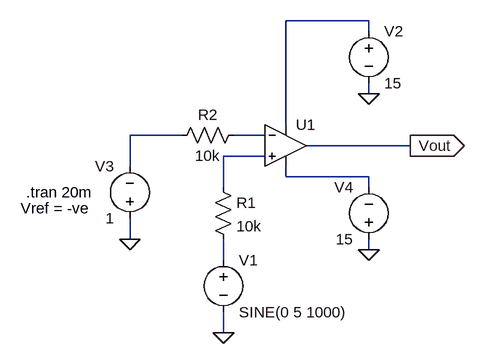
[diagram p0: schematic comparator_negref.asc]
comparator_negref.asc, the LTspice schematic file:
Version 4
SHEET 1 880 680
WIRE 400 -16 272 -16
WIRE 400 0 400 -16
WIRE 400 96 400 80
WIRE 272 144 272 -16
WIRE 112 160 32 160
WIRE 240 160 192 160
WIRE 464 176 304 176
WIRE 240 192 176 192
WIRE 32 208 32 160
WIRE 272 224 272 208
WIRE 400 224 272 224
WIRE 176 240 176 192
WIRE 400 240 400 224
WIRE 32 320 32 288
WIRE 400 336 400 320
WIRE 176 352 176 320
WIRE 176 464 176 432
FLAG 32 320 0
FLAG 176 464 0
FLAG 400 96 0
FLAG 400 336 0
FLAG 464 176 Vout
IOPIN 464 176 Out
SYMBOL OpAmps\\UniversalOpamp2 272 176 R0
SYMATTR InstName U1
SYMBOL voltage 176 336 R0
WINDOW 123 0 0 Left 0
WINDOW 39 0 0 Left 0
SYMATTR InstName V1
SYMATTR Value SINE(0 5 1000)
SYMBOL voltage 32 304 R180
WINDOW 0 24 96 Left 2
WINDOW 3 24 16 Left 2
WINDOW 123 0 0 Left 0
WINDOW 39 0 0 Left 0
SYMATTR InstName V3
SYMATTR Value 1
SYMBOL voltage 400 -16 R0
WINDOW 123 0 0 Left 0
WINDOW 39 0 0 Left 0
SYMATTR InstName V2
SYMATTR Value 15
SYMBOL voltage 400 336 R180
WINDOW 0 24 96 Left 2
WINDOW 3 24 16 Left 2
WINDOW 123 0 0 Left 0
WINDOW 39 0 0 Left 0
SYMATTR InstName V4
SYMATTR Value 15
SYMBOL res 160 224 R0
SYMATTR InstName R1
SYMATTR Value 10k
SYMBOL res 208 144 R90
WINDOW 0 0 56 VBottom 2
WINDOW 3 32 56 VTop 2
SYMATTR InstName R2
SYMATTR Value 10k
TEXT -128 248 Left 2 !.tran 20m
TEXT -136 272 Left 2 !Vref = -ve

The netlist it stands for:
* comparator_negref.asc
XU1 N004 N003 N001 N005 Vout level.2 Avol=1Meg GBW=10Meg Slew=10Meg ilimit=25m rail=0 Vos=0 phimargin=45 en=0 enk=0 in=0 ink=0 Rin=500Meg  ; pins IN+ IN- V+ V- OUT
V1 N006 0 SINE(0 5 1000)
V3 0 N002 1
V2 N001 0 15
V4 0 N005 15
R1 N004 N006 10k
R2 N003 N002 10k
.tran 20m
Vref = -ve
.lib UniversalOpamps2.sub
.backanno
.end